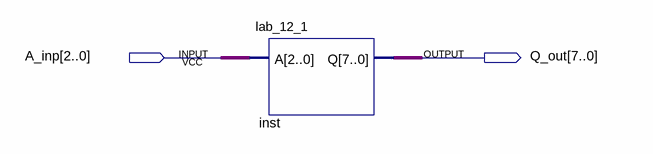
[diagram p0: schematic sheet]
// Quartus schematic Block1.bdf as structural Verilog: 1 symbols, 2 pins
module Block1 (
  input  [2:0] A_inp,
  output [7:0] Q_out
);

  lab_12_1 inst (.A(A_inp), .Q(Q_out));
endmodule
